# EAGLE design Transistores-v1 (EAGLE 6.3)
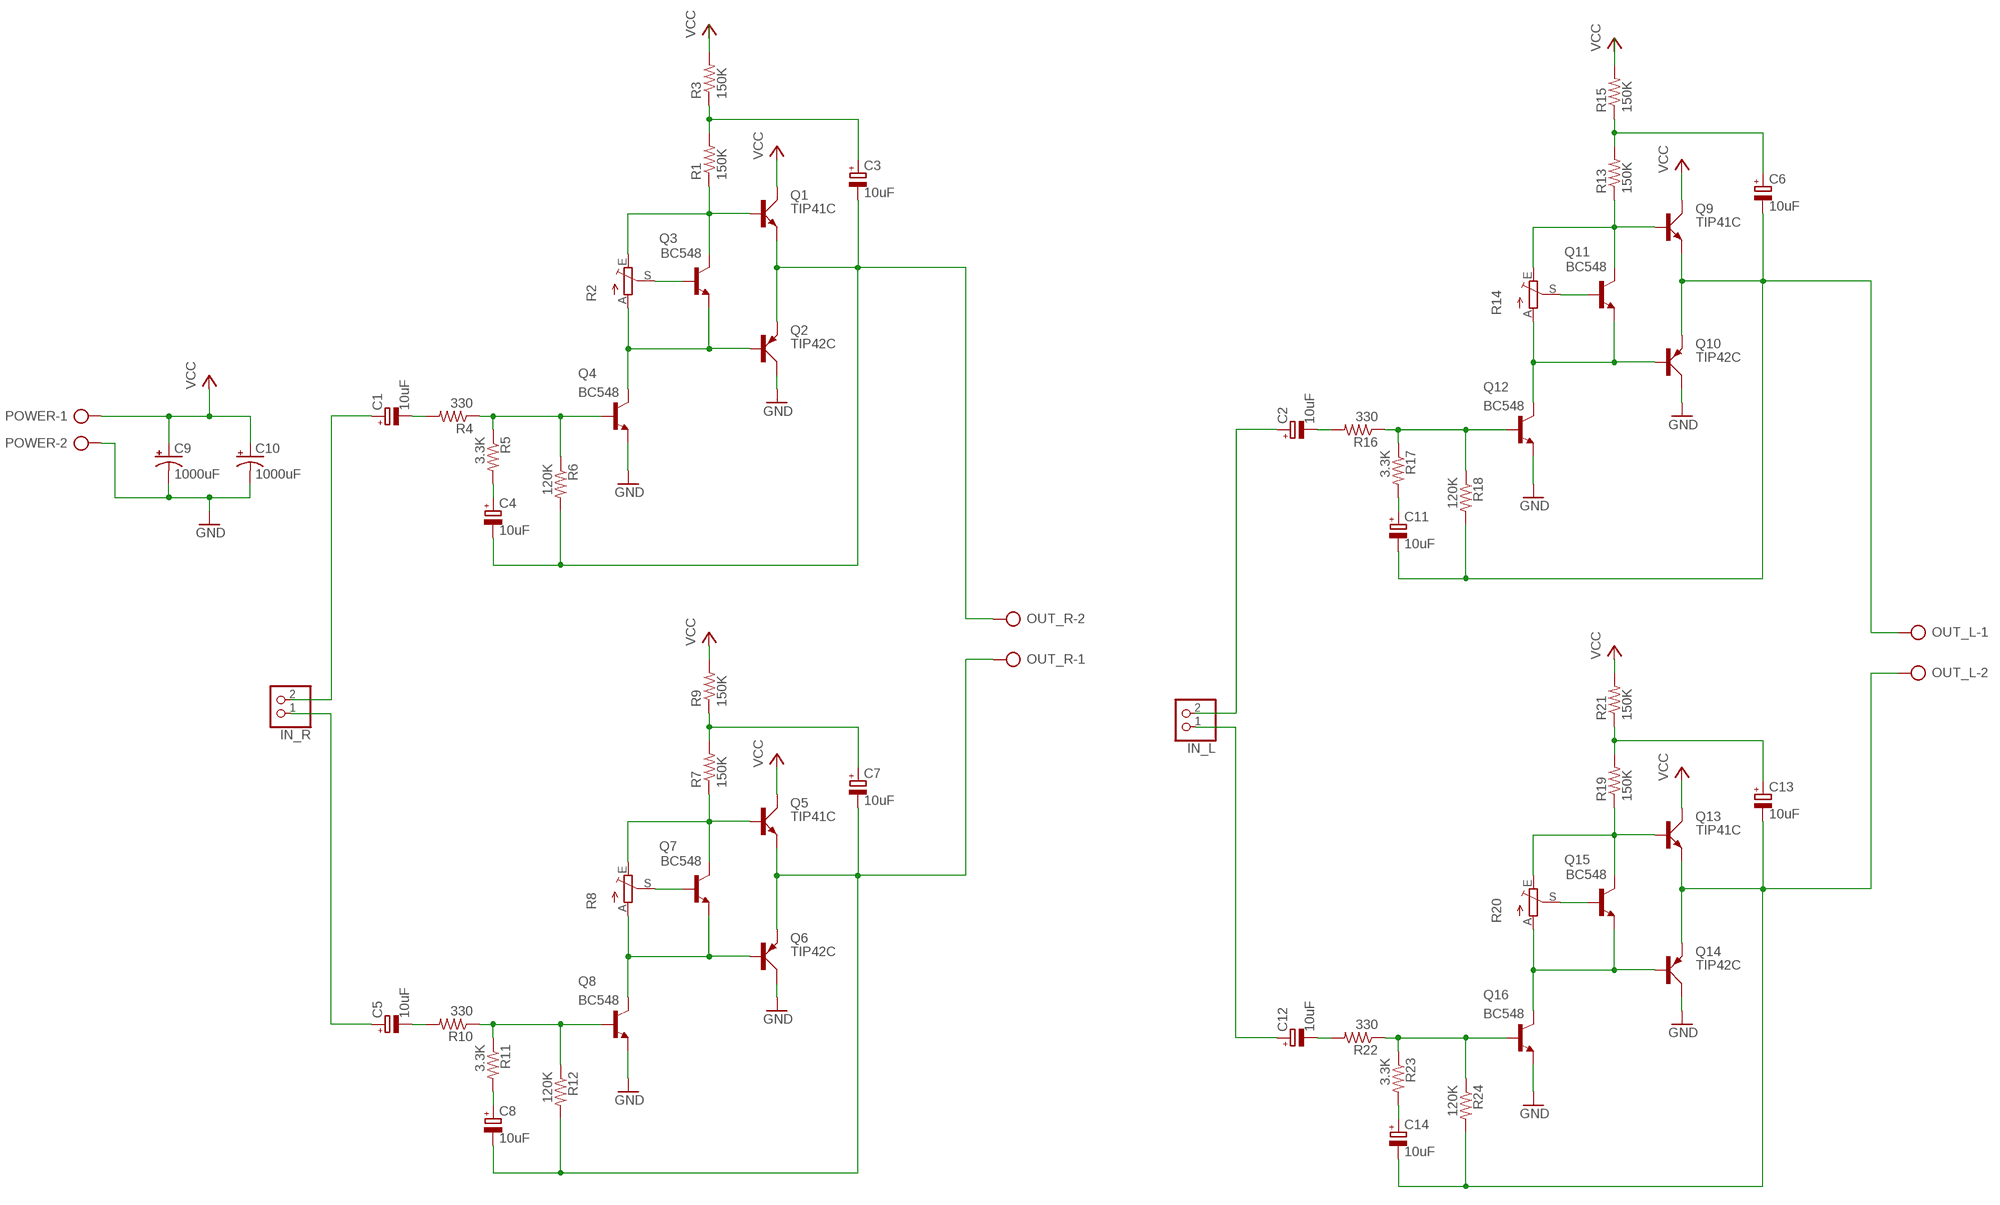
[diagram p0: schematic, sheet 1]

## Parts
C1  10uF  CPOL-EUE2.5-5  [E2,5-5]
C2  10uF  CPOL-EUE2.5-5  [E2,5-5]
C3  10uF  CPOL-EUE2.5-5  [E2,5-5]
C4  10uF  CPOL-EUE2.5-5  [E2,5-5]
C5  10uF  CPOL-EUE2.5-5  [E2,5-5]
C6  10uF  CPOL-EUE2.5-5  [E2,5-5]
C7  10uF  CPOL-EUE2.5-5  [E2,5-5]
C8  10uF  CPOL-EUE2.5-5  [E2,5-5]
C9  1000uF  CPOL-USE2.5-7  [E2,5-7]
C10  1000uF  CPOL-USE2.5-7  [E2,5-7]
C11  10uF  CPOL-EUE2.5-5  [E2,5-5]
C12  10uF  CPOL-EUE2.5-5  [E2,5-5]
C13  10uF  CPOL-EUE2.5-5  [E2,5-5]
C14  10uF  CPOL-EUE2.5-5  [E2,5-5]
IN_L  PINHD-1X2  [1X02]
IN_R  PINHD-1X2  [1X02]
OUT_L  AK300/2  [AK300/2]
OUT_R  AK300/2  [AK300/2]
POWER  AK300/2  [AK300/2]
Q1  TIP41C  [TO220AV]
Q2  TIP42C  [TO220AV]
Q3  BC548  [TO92-EBC]
Q4  BC548  [TO92-EBC]
Q5  TIP41C  [TO220AV]
Q6  TIP42C  [TO220AV]
Q7  BC548  [TO92-EBC]
Q8  BC548  [TO92-EBC]
Q9  TIP41C  [TO220AV]
Q10  TIP42C  [TO220AV]
Q11  BC548  [TO92-EBC]
Q12  BC548  [TO92-EBC]
Q13  TIP41C  [TO220AV]
Q14  TIP42C  [TO220AV]
Q15  BC548  [TO92-EBC]
Q16  BC548  [TO92-EBC]
R1  150K  R-US_0204/7  [0204/7]
R2  TRIM_EU-LI10  [LI10]
R3  150K  R-US_0204/7  [0204/7]
R4  330  R-US_0204/7  [0204/7]
R5  3.3K  R-US_0204/7  [0204/7]
R6  120K  R-US_0204/7  [0204/7]
R7  150K  R-US_0204/7  [0204/7]
R8  TRIM_EU-LI10  [LI10]
R9  150K  R-US_0204/7  [0204/7]
R10  330  R-US_0204/7  [0204/7]
R11  3.3K  R-US_0204/7  [0204/7]
R12  120K  R-US_0204/7  [0204/7]
R13  150K  R-US_0204/7  [0204/7]
R14  TRIM_EU-LI10  [LI10]
R15  150K  R-US_0204/7  [0204/7]
R16  330  R-US_0204/7  [0204/7]
R17  3.3K  R-US_0204/7  [0204/7]
R18  120K  R-US_0204/7  [0204/7]
R19  150K  R-US_0204/7  [0204/7]
R20  TRIM_EU-LI10  [LI10]
R21  150K  R-US_0204/7  [0204/7]
R22  330  R-US_0204/7  [0204/7]
R23  3.3K  R-US_0204/7  [0204/7]
R24  120K  R-US_0204/7  [0204/7]

## Nets
GND: C9.- C10.- POWER.2 Q2.C Q4.E Q6.C Q8.E Q10.C Q12.E Q14.C Q16.E
N$1: Q3.B R2.S
N$2: Q1.B Q3.C R1.1 R2.E
N$3: Q2.B Q3.E Q4.C R2.A
N$4: Q7.B R8.S
N$5: C1.+ IN_R.2
N$6: C3.+ R1.2 R3.1
N$7: Q4.B R4.1 R5.1 R6.1
N$8: C1.- R4.2
N$9: C4.+ R5.2
N$10: C3.- C4.- OUT_R.2 Q1.E Q2.E R6.2
N$11: Q5.B Q7.C R7.1 R8.E
N$12: Q6.B Q7.E Q8.C R8.A
N$13: C7.+ R7.2 R9.1
N$14: C5.+ IN_R.1
N$15: Q8.B R10.1 R11.1 R12.1
N$16: C5.- R10.2
N$17: C8.+ R11.2
N$18: C7.- C8.- OUT_R.1 Q5.E Q6.E R12.2
N$19: Q11.B R14.S
N$20: Q9.B Q11.C R13.1 R14.E
N$21: Q10.B Q11.E Q12.C R14.A
N$22: C6.+ R13.2 R15.1
N$23: Q12.B R16.1 R17.1 R18.1
N$24: C2.- R16.2
N$25: C11.+ R17.2
N$26: C6.- C11.- OUT_L.1 Q9.E Q10.E R18.2
N$27: Q15.B R20.S
N$28: Q13.B Q15.C R19.1 R20.E
N$29: Q14.B Q15.E Q16.C R20.A
N$30: C13.+ R19.2 R21.1
N$31: Q16.B R22.1 R23.1 R24.1
N$32: C12.- R22.2
N$33: C14.+ R23.2
N$34: C13.- C14.- OUT_L.2 Q13.E Q14.E R24.2
N$35: C2.+ IN_L.2
N$36: C12.+ IN_L.1
VCC: C9.+ C10.+ POWER.1 Q1.C Q5.C Q9.C Q13.C R3.2 R9.2 R15.2 R21.2

## Library data of the parts
C1-C8 C11-C14 = resistor:CPOL-EU: POLARIZED CAPACITOR, European symbol
C9 C10 = resistor:CPOL-US: POLARIZED CAPACITOR, American symbol
IN_L IN_R = pinhead:PINHD-1X2: PIN HEADER
OUT_L OUT_R POWER = con-ptr500:AK300/2: CONNECTOR; OC_FARNELL: unknown; OC_NEWARK: unknown
Q1 Q5 Q9 Q13 = transistor-power:TIP41C: NPN TRANSISTOR
Q2 Q6 Q10 Q14 = transistor-power:TIP42C: PNP TRANSISTOR
Q3 Q4 Q7 Q8 Q11 Q12 Q15 Q16 = transistor-npn:BC548*: NPN Transistor
R1 R3-R7 R9-R13 R15-R19 R21-R24 = resistor:R-US_: RESISTOR, American symbol
R2 R8 R14 R20 = pot:TRIM_EU-: POTENTIOMETER

## Board
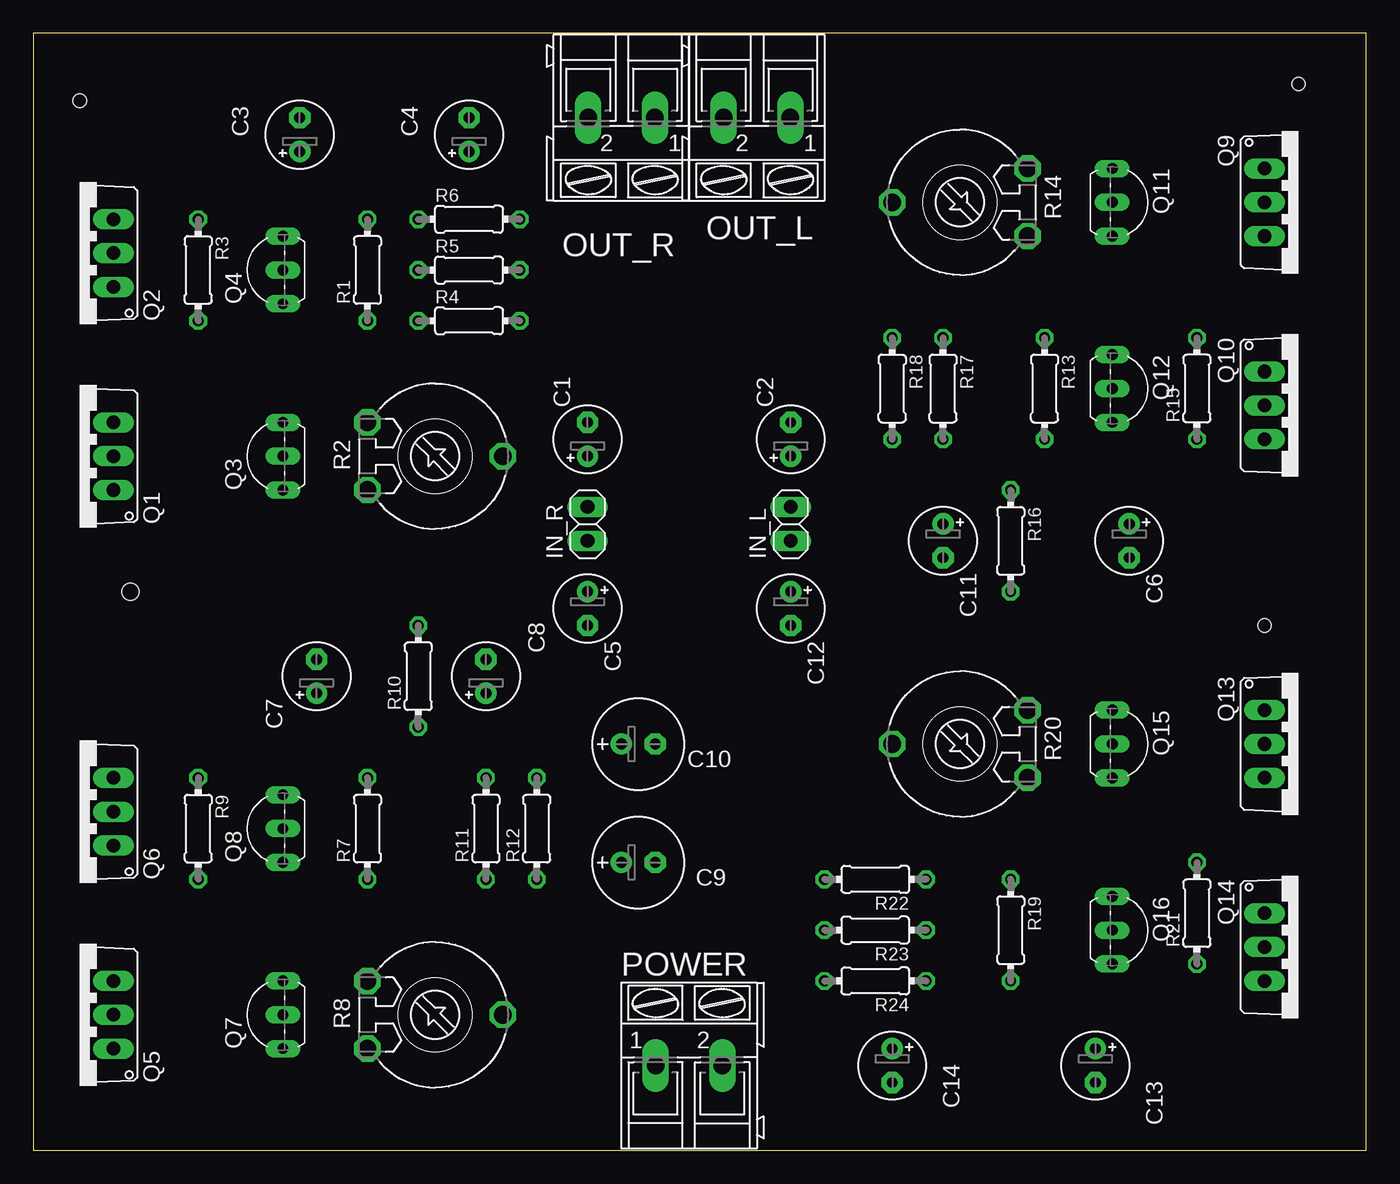
[diagram p1: board, top side]
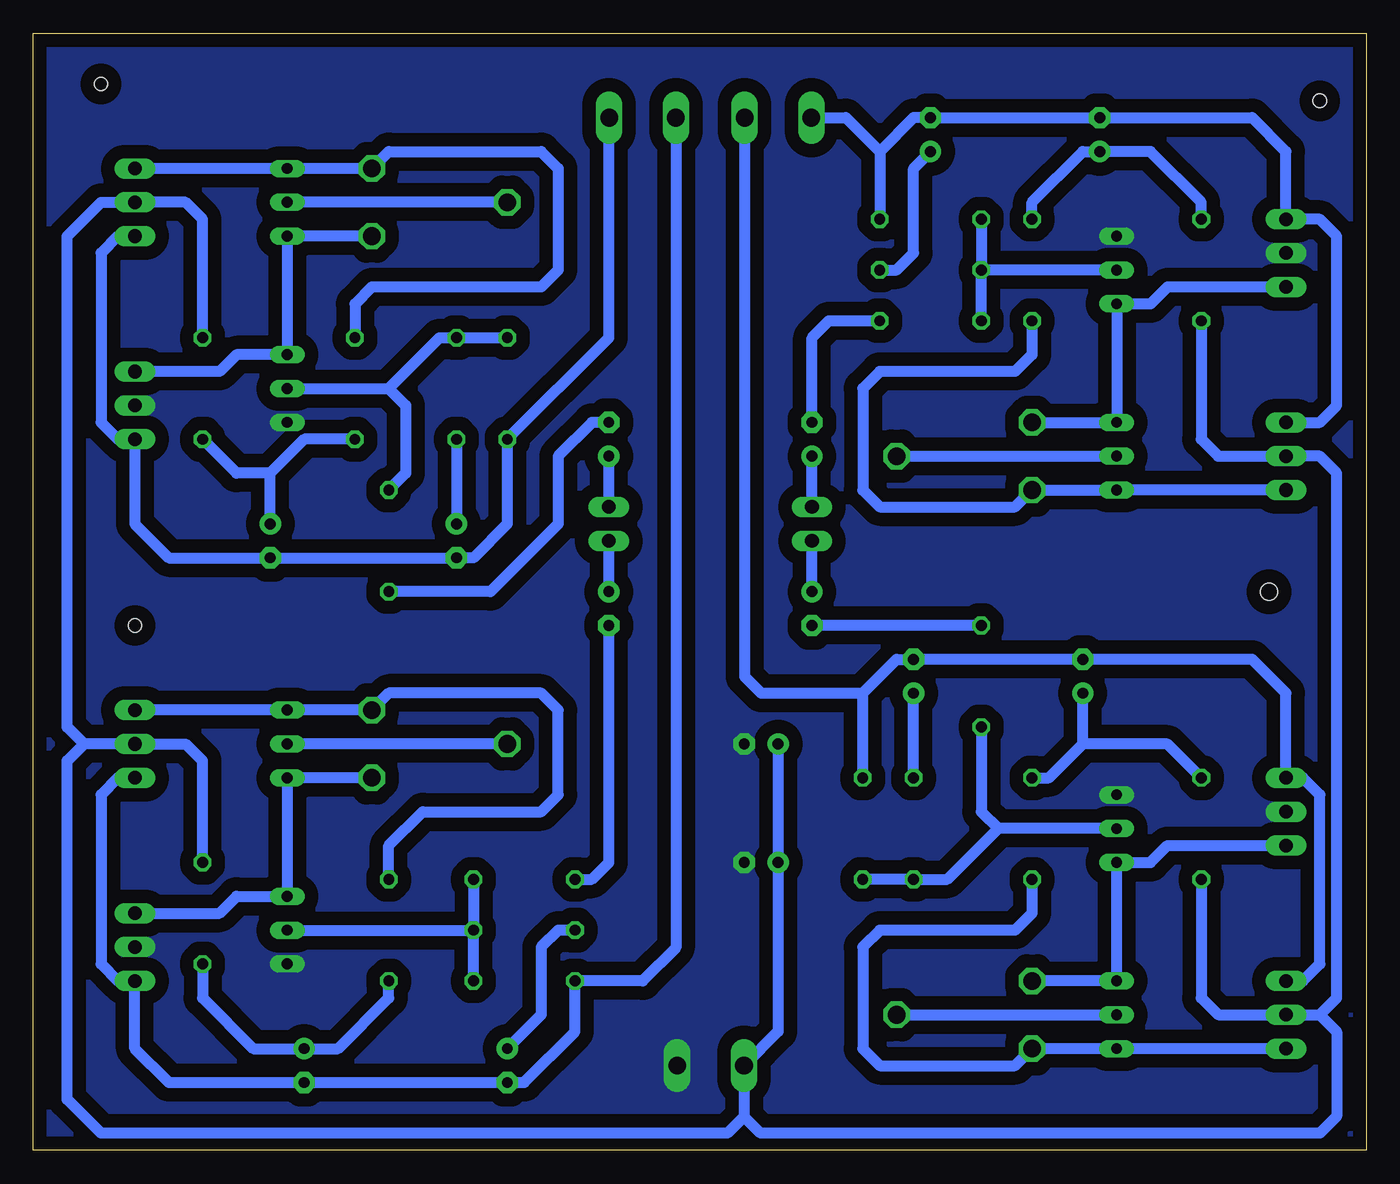
[diagram p2: board, bottom side, seen from below]

Size 100 x 83.8 mm. Coordinates in mm from the lower left corner, seen from the top.
Outline: 100,0 100,83.8 0,83.8 0,0 100,0
Copper layers (1*16): Top 0.035mm / dielectric 1.5mm / Bottom 0.035mm
Design rules "default": minimum track width 10mil, minimum drill 24mil, track to track 8mil, track to pad 8mil, pad to pad 8mil, via to via 8mil, smd to smd 8mil, copper to edge 40mil, drill to drill 8mil, minimum pad ring 10mil, minimum via ring 8mil, stop-mask expansion 4mil, vias tented up to drill 0mil, thermal gap 10mil
Holes 1.3 mm at 7.29,41.91
Holes 1 mm at 3.48,78.74 94.92,80.01 92.38,39.37

### Footprints (pad centres in the part's own frame; a part is rotated, then mirrored left to right if it is on the bottom)
E2,5-5 = drill 0.813 pad 1.6: + -1.27,0 | drill 0.813 pad 1.6 octagon: - 1.27,0
E2,5-7 = drill 0.813 pad 1.6: + -1.27,0 | drill 0.813 pad 1.6 octagon: - 1.27,0
1X02 = drill 1.016 long: 1 -1.27,0; 2 1.27,0
AK300/2 = drill 1.321 long: 1 -2.515,0; 2 2.489,0
TO220AV = drill 1.016 long: B -2.54,-2.54; C 0,-2.54; E 2.54,-2.54
TO92-EBC = drill 0.813 long: B 0,-1.27; C -2.54,-1.27; E 2.54,-1.27
0204/7 = drill 0.813 octagon: 1 -3.81,0; 2 3.81,0
LI10 = drill 1.321 octagon: A -2.54,-5.08; E 2.54,-5.08; S 0,5.08

### Placement (x,y rotation side)
C1  41.58,53.34 90 top
C2  56.82,53.34 90 top
C3  19.99,76.2 90 top
C4  32.69,76.2 90 top
C5  41.58,40.64 270 top
C6  82.22,45.72 270 top
C7  21.26,35.56 90 top
C8  33.96,35.56 90 top
C9  45.39,21.59 0 top
C10  45.39,30.48 0 top
C11  68.25,45.72 270 top
C12  56.82,40.64 270 top
C13  79.68,6.35 270 top
C14  64.44,6.35 270 top
IN_L  56.82,46.99 90 top
IN_R  41.58,46.99 90 top
OUT_L  54.28,77.47 180 top
OUT_R  44.12,77.47 180 top
POWER  49.2,6.35 0 top
Q1  3.48,52.07 90 top
Q2  3.48,67.31 90 top
Q3  17.45,52.07 90 top
Q4  17.45,66.04 90 top
Q5  3.48,10.16 90 top
Q6  3.48,25.4 90 top
Q7  17.45,10.16 90 top
Q8  17.45,24.13 90 top
Q9  94.92,71.12 270 top
Q10  94.92,55.88 270 top
Q11  82.22,71.12 270 top
Q12  82.22,57.15 270 top
Q13  94.92,30.48 270 top
Q14  94.92,15.24 270 top
Q15  82.22,30.48 270 top
Q16  82.22,16.51 270 top
R1  25.07,66.04 90 top
R2  30.15,52.07 270 top
R3  12.37,66.04 270 top
R4  32.69,62.23 0 top
R5  32.69,66.04 0 top
R6  32.69,69.85 0 top
R7  25.07,24.13 90 top
R8  30.15,10.16 270 top
R9  12.37,24.13 270 top
R10  28.88,35.56 90 top
R11  33.96,24.13 90 top
R12  37.77,24.13 90 top
R13  75.87,57.15 270 top
R14  69.52,71.12 90 top
R15  87.3,57.15 90 top
R16  73.33,45.72 270 top
R17  68.25,57.15 270 top
R18  64.44,57.15 270 top
R19  73.33,16.51 270 top
R20  69.52,30.48 90 top
R21  87.3,17.78 90 top
R22  63.17,20.32 180 top
R23  63.17,16.51 180 top
R24  63.17,12.7 180 top

### Tracks (layer width: path | path; a pad name or v marks a point on that pad's centre or on a via)
GND
  pour Bottom (isolate 1.016, no thermals): 100,0 -0.33,0 -0.33,83.82 100,83.82
N$1
  Bottom 0.813: R2.S Q3.B
N$2
  Bottom 0.813: Q1.B Q3.C R2.E 26.34,48.26 36.5,48.26 37.77,49.53 37.77,57.15 36.5,58.42 26.34,58.42 25.07,59.69 R1.1
N$3
  Bottom 0.813: R2.A Q3.E Q4.C 16.18,63.5 14.91,64.77 Q2.B
N$4
  Bottom 0.813: R8.S Q7.B
N$5
  Bottom 0.813: IN_R.2 C1.+
N$6
  Bottom 0.813: R3.1 12.37,71.12 16.18,74.93 C3.+ 21.26,74.93 25.07,71.12 R1.2
N$7
  Bottom 0.813: Q4.B R5.1 | R4.1 R5.1 | R6.1 R5.1
N$8
  Bottom 0.813: C1.- 41.58,60.96 40.31,62.23 R4.2
N$9
  Bottom 0.813: R5.2 35.23,66.04 33.96,67.31 33.96,73.66 C4.+
N$10
  Bottom 0.813: Q1.E 3.48,54.61 2.21,55.88 2.21,68.58 3.48,69.85 Q2.E 6.02,74.93 8.56,77.47 C3.- C4.- 33.96,77.47 36.5,74.93 | 36.5,74.93 R6.2 | OUT_R.2 39.04,77.47 36.5,74.93
N$11
  Bottom 0.813: Q5.B Q7.C R8.E 26.34,6.35 36.5,6.35 37.77,7.62 37.77,15.24 36.5,16.51 26.34,16.51 25.07,17.78 R7.1
N$12
  Bottom 0.813: R8.A Q7.E Q8.C 16.18,21.59 14.91,22.86 Q6.B
N$13
  Bottom 0.813: R7.2 23.8,27.94 21.26,30.48 | 21.26,30.48 C7.+ | R9.1 14.91,30.48 21.26,30.48
N$14
  Bottom 0.813: C5.+ IN_R.1
N$15
  Bottom 0.813: Q8.B 27.61,24.13 | R12.1 R11.1 31.42,20.32 27.61,24.13 | R10.1 28.88,25.4 27.61,24.13
N$16
  Bottom 0.813: R10.2 C5.-
N$17
  Bottom 0.813: R11.2 C8.+
N$18
  Bottom 0.813: Q5.E 4.75,12.7 3.48,13.97 3.48,26.67 4.75,27.94 Q6.E 6.02,34.29 8.56,36.83 C7.- C8.- 35.23,36.83 37.77,34.29 | R12.2 37.77,34.29 | 37.77,34.29 45.39,34.29 46.64,35.53 OUT_R.1
N$19
  Bottom 0.813: R14.S Q11.B
N$20
  Bottom 0.813: Q9.B Q11.C R14.E 73.33,74.93 61.9,74.93 60.63,73.66 60.63,66.04 61.9,64.77 74.6,64.77 75.87,63.5 R13.1
N$21
  Bottom 0.813: R14.A Q11.E Q12.C 84.76,59.69 86.03,58.42 Q10.B
N$22
  Bottom 0.813: C6.+ 82.22,50.8 | 82.22,50.8 84.76,50.8 R15.1 | R13.2 79.68,53.34 82.22,50.8
N$23
  Bottom 0.813: Q12.B 73.33,57.15 | R18.1 R17.1 69.52,60.96 73.33,57.15 | 73.33,57.15 72.06,55.88 72.06,50.8 R16.1
N$24
  Bottom 0.813: C2.- 58.09,54.61 60.63,52.07 60.63,46.99 65.71,41.91 R16.2
N$25
  Bottom 0.813: R17.2 C11.+
N$26
  Bottom 0.813: Q9.E 93.65,68.58 94.92,67.31 94.92,54.61 93.65,53.34 Q10.E 92.38,46.99 89.84,44.45 C6.- C11.- 66.98,44.45 64.44,46.99 R18.2 56.82,60.96 56.82,77.44 OUT_L.1 56.82,77.47
N$27
  Bottom 0.813: R20.S Q15.B
N$28
  Bottom 0.813: Q13.B Q15.C R20.E 73.33,34.29 61.9,34.29 60.63,33.02 60.63,26.67 61.9,25.4 70.79,25.4 73.33,22.86 R19.1
N$29
  Bottom 0.813: R20.A Q15.E Q16.C 84.76,19.05 86.03,17.78 Q14.B
N$30
  Bottom 0.813: R21.1 87.3,11.43 83.49,7.62 C13.+ 77.14,7.62 73.33,11.43 R19.2
N$31
  Bottom 0.813: R24.1 R23.1 | R22.1 R23.1 | Q16.B R23.1
N$32
  Bottom 0.813: R22.2 58.09,20.32 56.82,21.59 C12.-
N$33
  Bottom 0.813: R23.2 60.63,16.51 61.9,15.24 61.9,10.16 C14.+
N$34
  Bottom 0.813: Q13.E 93.65,27.94 94.92,26.67 94.92,13.97 93.65,12.7 Q14.E 92.38,7.62 89.84,5.08 C13.- C14.- 63.17,5.08 59.36,8.89 R24.2 54.28,12.7 51.79,15.19 OUT_L.2
N$35
  Bottom 0.813: IN_L.2 C2.+
N$36
  Bottom 0.813: C12.+ IN_L.1
VCC
  Bottom 0.813: R9.2 12.37,11.43 11.1,10.16 Q5.C 3.48,10.16 | R3.2 12.37,53.34 11.1,52.07 Q1.C 3.48,52.07 2.21,50.8 2.21,11.43 3.48,10.16 | R15.2 87.3,69.85 88.57,71.12 Q9.C 94.92,71.12 97.46,68.58 97.46,31.75 96.19,30.48 | R21.2 87.3,29.21 88.57,30.48 Q13.C 96.19,30.48 | 3.48,10.16 2.21,8.89 2.21,2.54 3.48,1.27 45.44,1.27 46.69,2.52 | 96.19,30.48 97.46,29.21 97.46,3.81 94.92,1.27 47.93,1.27 46.69,2.52 | 46.69,2.52 POWER.1 44.12,8.91 C9.+ C10.+